# Altium schematic sheet Sheet1.SchDoc
size A3; SheetNumber: 1; SheetTotal: 1
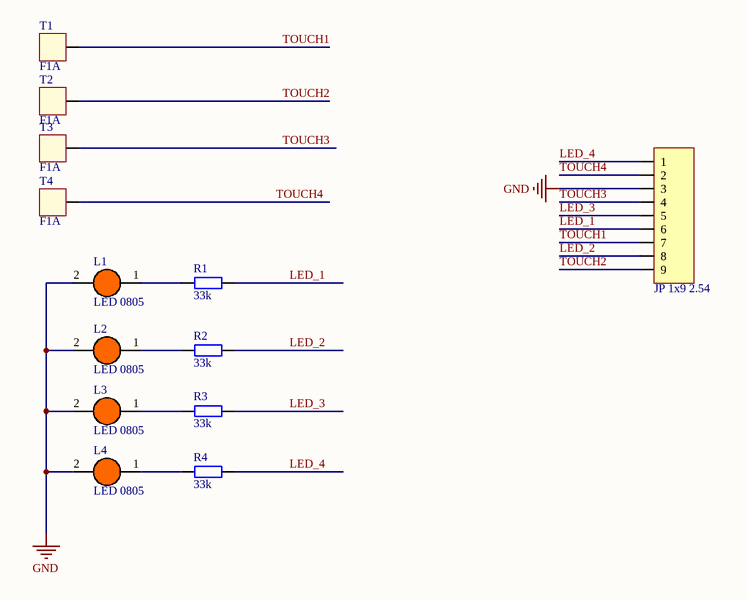
[diagram p0: Sheet1.SchDoc]

## Parts
JP1  JP 1x9 2.54  [JP 1x9 CT]
L1  LED 0805  [LED-0805-Orange]
L2  LED 0805  [LED-0805-Orange]
L3  LED 0805  [LED-0805-Orange]
L4  LED 0805  [LED-0805-Orange]
R1  33k  [tro smd 0805]
R2  33k  [tro smd 0805]
R3  33k  [tro smd 0805]
R4  33k  [tro smd 0805]
T1  F1A  [Touch]
T2  F1A  [Touch]
T3  F1A  [Touch]
T4  F1A  [Touch]

## Nets
GND: JP1.3 L1.2(K) L2.2(K) L3.2(K) L4.2(K)
LED_1: JP1.6 R1.1
LED_2: JP1.8 R2.1
LED_3: JP1.5 R3.1
LED_4: JP1.1 R4.1
TOUCH1: JP1.7 T1.1
TOUCH2: JP1.9 T2.1
TOUCH3: JP1.4 T3.1
TOUCH4: JP1.2 T4.1
NetL1_1: L1.1(A) R1.2
NetL2_1: L2.1(A) R2.2
NetL3_1: L3.1(A) R3.2
NetL4_1: L4.1(A) R4.2

## Library data of the parts
JP1 = JP 1x9 2.54 Cai Thang: Cắm; Ten_Linh_Kien: Jump Đơn Cái 2.54MM 1x20P Thẳng; Don_Vi: Con; Ma_Hang: MH004006; Ghi_Chu: *; Kieu_Chan: *; Chung_Loai: Cắm
L1-L4 = LED 0805 Cam: Dán; Don_Vi: Con; Ma_Hang: MH002328; Ten_Linh_Kien: LED 0805 Màu Cam ( Orange); Ghi_Chu: *; Kieu_Chan: *; Chung_Loai: Dán
R1-R4 = Tro 0805 1% 33k: Dán; Don_Vi: Con; So_Chan: 2; Ten_Linh_Kien: Trở 0805 1% 33k; Ma_Hang: MH005478; Chung_Loai: Dán; Kieu_Chan: *
T1-T4 = Touch: Fuse; Designed by: VanDungEvn; Value: Fuse